# EAGLE design X16-Backplane1 (EAGLE 9.6.2)

## Sheet 1 of 2
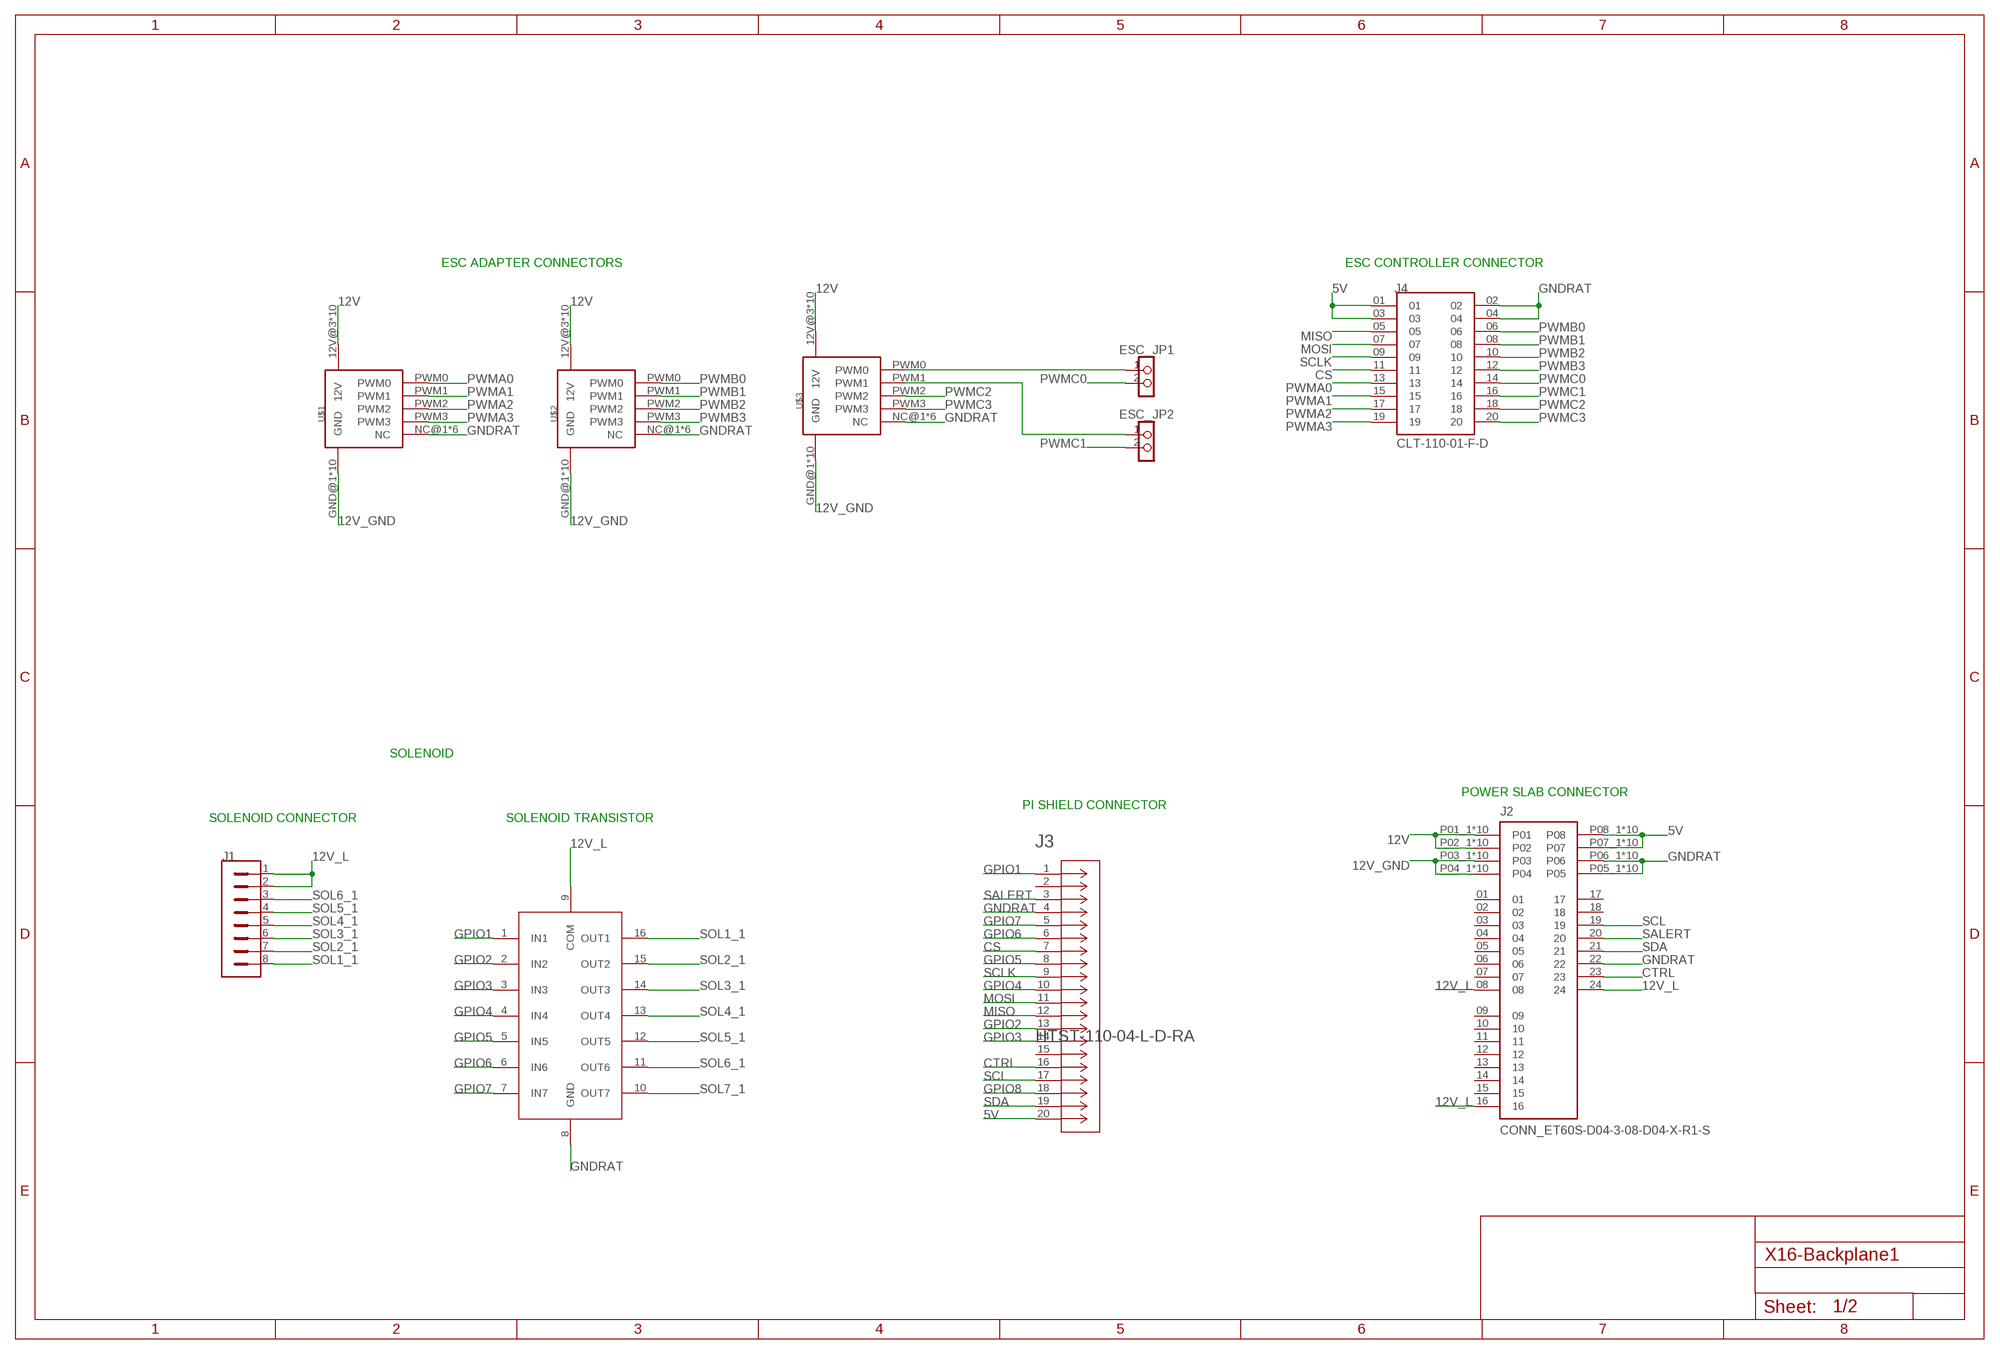
[diagram p0: schematic, sheet 1]

### Parts
ESC_JP1  TEST_PIN-1X2  [1X02]
ESC_JP2  TEST_PIN-1X2  [1X02]
J1  CONN_PXC-8-RA-1778683  [PXC-8-RA-1778683]
J2  CONN_ET60S-D04-3-08-D04-X-R1-S  [SAMTEC_ET60S-D04-3-08-D04-X-R1-S]
J3  HTST-110-04-L-D-RA  [CONN_HTST-110-04/05-X-D-RA_SAI]
J4  CLT-110-01-F-D  [SAMTEC_CLT-110-01-F-D]
U2  TRANS_ULN2003AD  [16-SOIC]
U$1  CONN_BACKPLANE_ESC_ADAPTER_NEW  [CONN_BACKPLANE_ESC_ADAPTER]
U$2  CONN_BACKPLANE_ESC_ADAPTER_NEW  [CONN_BACKPLANE_ESC_ADAPTER]
U$3  CONN_BACKPLANE_ESC_ADAPTER_NEW  [CONN_BACKPLANE_ESC_ADAPTER]

### Nets
5V: J2.P07_1(P07) J2.P07_2(P07) J2.P07_3(P07) J2.P07_4(P07) J2.P07_5(P07) J2.P07_6(P07) J2.P07_7(P07) J2.P07_8(P07) J2.P07_9(P07) J2.P07_10(P07) J2.P08_1(P08) J2.P08_2(P08) J2.P08_3(P08) J2.P08_4(P08) J2.P08_5(P08) J2.P08_6(P08) J2.P08_7(P08) J2.P08_8(P08) J2.P08_9(P08) J2.P08_10(P08) J3.20 J4.01 J4.03 ; also sheet 2
12V: J2.P01_1(P01) J2.P01_2(P01) J2.P01_3(P01) J2.P01_4(P01) J2.P01_5(P01) J2.P01_6(P01) J2.P01_7(P01) J2.P01_8(P01) J2.P01_9(P01) J2.P01_10(P01) J2.P02_1(P02) J2.P02_2(P02) J2.P02_3(P02) J2.P02_4(P02) J2.P02_5(P02) J2.P02_6(P02) J2.P02_7(P02) J2.P02_8(P02) J2.P02_9(P02) J2.P02_10(P02) U$1.12V@3(12V) U$1.12V@4(12V) U$1.12V@5(12V) U$1.12V@6(12V) U$1.12V@7(12V) U$1.12V@8(12V) U$1.12V@9(12V) U$1.12V@10(12V) U$1.12V@11(12V) U$1.12V@12(12V) U$2.12V@3(12V) U$2.12V@4(12V) U$2.12V@5(12V) U$2.12V@6(12V) U$2.12V@7(12V) U$2.12V@8(12V) U$2.12V@9(12V) U$2.12V@10(12V) U$2.12V@11(12V) U$2.12V@12(12V) U$3.12V@3(12V) U$3.12V@4(12V) U$3.12V@5(12V) U$3.12V@6(12V) U$3.12V@7(12V) U$3.12V@8(12V) U$3.12V@9(12V) U$3.12V@10(12V) U$3.12V@11(12V) U$3.12V@12(12V) ; also sheet 2
12V_GND: J2.P03_1(P03) J2.P03_2(P03) J2.P03_3(P03) J2.P03_4(P03) J2.P03_5(P03) J2.P03_6(P03) J2.P03_7(P03) J2.P03_8(P03) J2.P03_9(P03) J2.P03_10(P03) J2.P04_1(P04) J2.P04_2(P04) J2.P04_3(P04) J2.P04_4(P04) J2.P04_5(P04) J2.P04_6(P04) J2.P04_7(P04) J2.P04_8(P04) J2.P04_9(P04) J2.P04_10(P04) U$1.GND@1(GND) U$1.GND@2(GND) U$1.GND@3(GND) U$1.GND@4(GND) U$1.GND@5(GND) U$1.GND@6(GND) U$1.GND@7(GND) U$1.GND@8(GND) U$1.GND@9(GND) U$1.GND@10(GND) U$2.GND@1(GND) U$2.GND@2(GND) U$2.GND@3(GND) U$2.GND@4(GND) U$2.GND@5(GND) U$2.GND@6(GND) U$2.GND@7(GND) U$2.GND@8(GND) U$2.GND@9(GND) U$2.GND@10(GND) U$3.GND@1(GND) U$3.GND@2(GND) U$3.GND@3(GND) U$3.GND@4(GND) U$3.GND@5(GND) U$3.GND@6(GND) U$3.GND@7(GND) U$3.GND@8(GND) U$3.GND@9(GND) U$3.GND@10(GND) ; also sheet 2
12V_L: J1.1 J1.2 J2.08 J2.16 J2.24 U2.9(COM)
CS: J3.7 J4.11 ; also sheet 2
CTRL: J2.23 J3.16
GNDRAT: J2.22 J2.P05_1(P05) J2.P05_2(P05) J2.P05_3(P05) J2.P05_4(P05) J2.P05_5(P05) J2.P05_6(P05) J2.P05_7(P05) J2.P05_8(P05) J2.P05_9(P05) J2.P05_10(P05) J2.P06_1(P06) J2.P06_2(P06) J2.P06_3(P06) J2.P06_4(P06) J2.P06_5(P06) J2.P06_6(P06) J2.P06_7(P06) J2.P06_8(P06) J2.P06_9(P06) J2.P06_10(P06) J3.4 J4.02 J4.04 U2.8(GND) U$1.NC@1(NC) U$1.NC@2(NC) U$1.NC@3(NC) U$1.NC@4(NC) U$1.NC@5(NC) U$1.NC@6(NC) U$2.NC@1(NC) U$2.NC@2(NC) U$2.NC@3(NC) U$2.NC@4(NC) U$2.NC@5(NC) U$2.NC@6(NC) U$3.NC@1(NC) U$3.NC@2(NC) U$3.NC@3(NC) U$3.NC@4(NC) U$3.NC@5(NC) U$3.NC@6(NC) ; also sheet 2
GPIO1: J3.1 U2.1(IN1)
GPIO2: J3.13 U2.2(IN2)
GPIO3: J3.14 U2.3(IN3)
GPIO4: J3.10 U2.4(IN4)
GPIO5: J3.8 U2.5(IN5)
GPIO6: J3.6 U2.6(IN6)
GPIO7: J3.5 U2.7(IN7)
GPIO8: J3.18
MISO: J3.12 J4.05 ; also sheet 2
MOSI: J3.11 J4.07 ; also sheet 2
N$1: ESC_JP1.1 U$3.PWM0
N$3: ESC_JP2.1 U$3.PWM1
PWMA0: J4.13 U$1.PWM0
PWMA1: J4.15 U$1.PWM1
PWMA2: J4.17 U$1.PWM2
PWMA3: J4.19 U$1.PWM3
PWMB0: J4.06 U$2.PWM0
PWMB1: J4.08 U$2.PWM1
PWMB2: J4.10 U$2.PWM2
PWMB3: J4.12 U$2.PWM3
PWMC0: ESC_JP1.2 J4.14 ; also sheet 2
PWMC1: ESC_JP2.2 J4.16 ; also sheet 2
PWMC2: J4.18 U$3.PWM2
PWMC3: J4.20 U$3.PWM3
SALERT: J2.20 J3.3
SCL: J2.19 J3.17
SCLK: J3.9 J4.09 ; also sheet 2
SDA: J2.21 J3.19
SOL1_1: J1.8 U2.16(OUT1)
SOL2_1: J1.7 U2.15(OUT2)
SOL3_1: J1.6 U2.14(OUT3)
SOL4_1: J1.5 U2.13(OUT4)
SOL5_1: J1.4 U2.12(OUT5)
SOL6_1: J1.3 U2.11(OUT6)
SOL7_1: U2.10(OUT7)
Unconnected: J2.01 J2.02 J2.03 J2.04 J2.05 J2.06 J2.07 J2.09 J2.10 J2.11 J2.12 J2.13 J2.14 J2.15 J2.17 J2.18 J3.2 J3.15

### Notes on the sheet
- ESC ADAPTER CONNECTORS | ESC CONTROLLER CONNECTOR
- SOLENOID
- POWER SLAB CONNECTOR
- PI SHIELD CONNECTOR
- SOLENOID CONNECTOR | SOLENOID TRANSISTOR

## Sheet 2 of 2
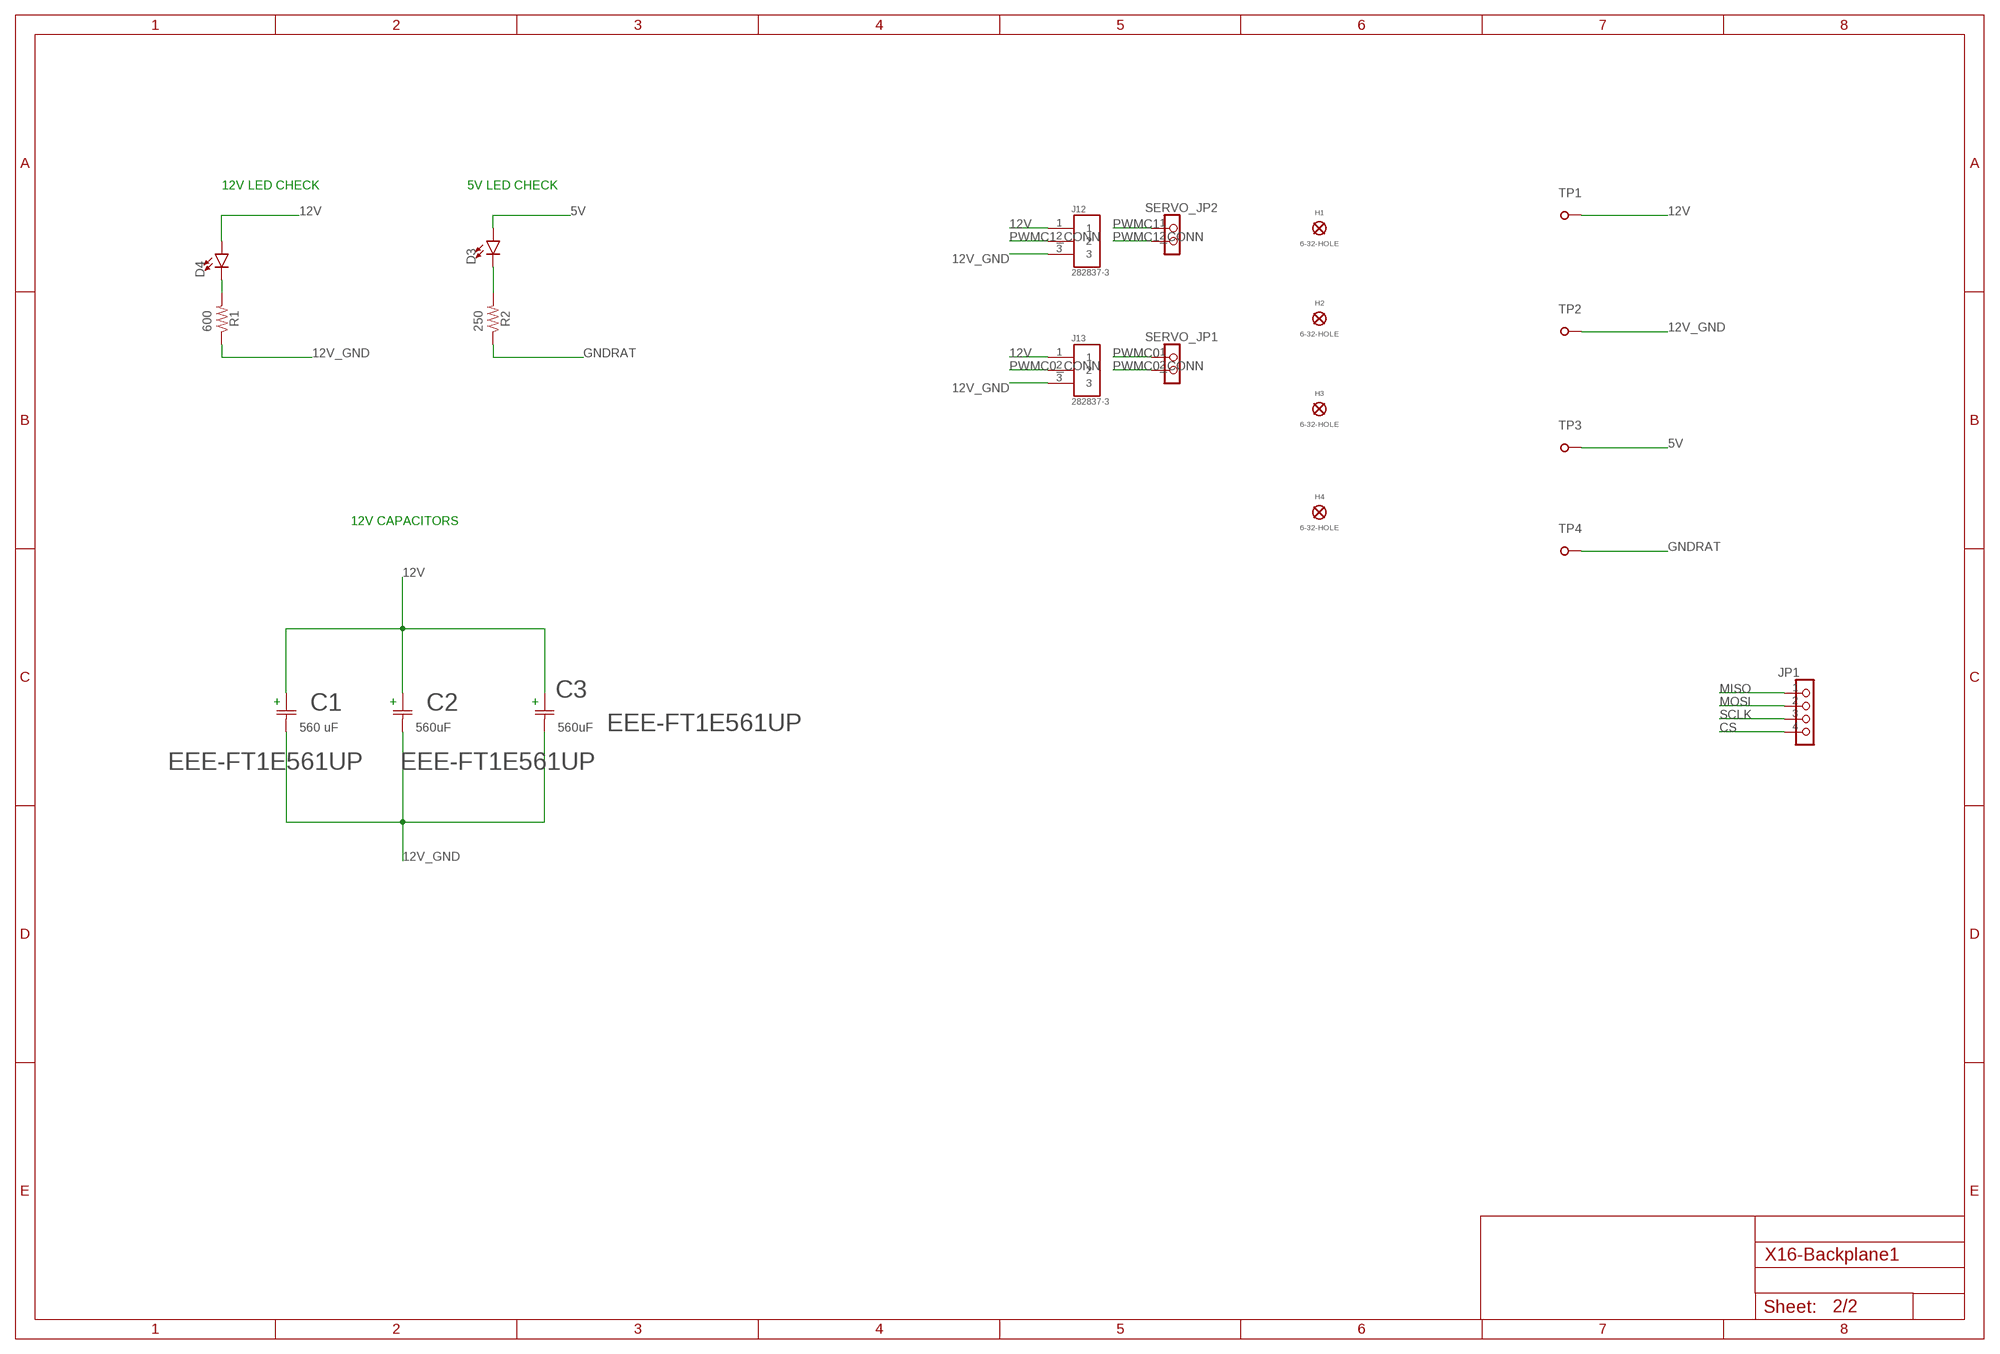
[diagram p1: schematic, sheet 2]

### Parts
C1  EEE-FT1E561UP  [CAP_FT_F_PAN]
C2  EEE-FT1E561UP  [CAP_FT_F_PAN]
C3  EEE-FT1E561UP  [CAP_FT_F_PAN]
D3  LEDCHIPLED_0805  [CHIPLED_0805]
D4  LEDCHIPLED_0805  [CHIPLED_0805]
H1  6-32-HOLE  [6-32-HOLE]
H2  6-32-HOLE  [6-32-HOLE]
H3  6-32-HOLE  [6-32-HOLE]
H4  6-32-HOLE  [6-32-HOLE]
J12  282837-3  [TE_282837-3]
J13  282837-3  [TE_282837-3]
JP1  TEST_PIN-1X4  [1X04]
R1  RESISTOR0603  [0603]
R2  RESISTOR0603  [0603]
SERVO_JP1  TEST_PIN-1X2  [1X02]
SERVO_JP2  TEST_PIN-1X2  [1X02]
TP1  TESTPOINT_5.04MM  [TESTPOINT_5.04MM]
TP2  TESTPOINT_5.04MM  [TESTPOINT_5.04MM]
TP3  TESTPOINT_5.04MM  [TESTPOINT_5.04MM]
TP4  TESTPOINT_5.04MM  [TESTPOINT_5.04MM]

### Nets
5V: D3.A TP3.TP ; also sheet 1
12V: C1.1 C2.1 C3.1 D4.A J12.1 J13.1 TP1.TP ; also sheet 1
12V_GND: C1.2 C2.2 C3.2 J12.3 J13.3 R1.1 TP2.TP ; also sheet 1
CS: JP1.4 ; also sheet 1
GNDRAT: R2.1 TP4.TP ; also sheet 1
MISO: JP1.1 ; also sheet 1
MOSI: JP1.2 ; also sheet 1
N$2: D4.C R1.2
N$5: D3.C R2.2
PWMC0: SERVO_JP1.1 ; also sheet 1
PWMC0_CONN: J13.2 SERVO_JP1.2
PWMC1: SERVO_JP2.1 ; also sheet 1
PWMC1_CONN: J12.2 SERVO_JP2.2
SCLK: JP1.3 ; also sheet 1

### Notes on the sheet
- 12V LED CHECK | 5V LED CHECK
- 12V CAPACITORS
- + | + | +

## Library data of the parts
C1 = X16_Backplane:EEE-FT1E561UP; C1: 560 uF; COPYRIGHT: Copyright (C) 2023 Ultra Librarian. All rights reserved.; MANUFACTURER_PART_NUMBER: EEE-FT1E561UP; MFR_NAME: Panasonic
C2 = X16_Backplane:EEE-FT1E561UP; C2: 560uF; COPYRIGHT: Copyright (C) 2023 Ultra Librarian. All rights reserved.; MANUFACTURER_PART_NUMBER: EEE-FT1E561UP; MFR_NAME: Panasonic
C3 = X16_Backplane:EEE-FT1E561UP; C3: 560uF; COPYRIGHT: Copyright (C) 2023 Ultra Librarian. All rights reserved.; MANUFACTURER_PART_NUMBER: EEE-FT1E561UP; MFR_NAME: Panasonic
D3 D4 = led:LED: LED OSRAM: - CHIPLED LG R971, LG N971, LY N971, LG Q971, LY Q971, LO R971, LY R971 LH N974, LH R974 LS Q976, LO Q976, LY Q976 LO Q996 - Hyper CHIPLED LW Q18S LB Q993, LB Q99A, LB R99A - SideLED LS A670, LO A670, LY A670, LG A670, LP A670 LB A673, LV A673, LT A673, LW A673 LH A674 LY A675 LS A676, LA A676, LO A676, LY A676, LW A676 LS A679, LY A679, LG A679 - Hyper Micro SIDELED® LS Y876, LA Y876, LO Y876, LY Y876 LT Y87S - SmartLED LW L88C, LW L88S LB L89C, LB L89S, LG L890 LS L89K, LO L89K, LY L89K LS L896, LA L896, LO L896, LY L896 - TOPLED LS T670, LO T670, LY T670, LG T670, LP T670 LSG T670, LSP T670, LSY T670, LOP T670, LYG T670 LG T671, LOG T671, LSG T671 LB T673, LV T673, LT T673, LW T673 LH T674 LS T676, LA T676, LO T676, LY T676, LB T676, LH T676, LSB T676, LW T676 LB T67C, LV T67C, LT T67C, LS T67K, LO T67K, LY T67K, LW E67C LS E67B, LA E67B, LO E67B, LY E67B, LB E67C, LV E67C, LT E67C LW T67C LS T679, LY T679, LG T679 LS T770, LO T770, LY T770, LG T770, LP T770 LB T773, LV T773, LT T773, LW T773 LH T774 LS E675, LA E675, LY E675, LS T675 LS T776, LA T776, LO T776, LY T776, LB T776 LHGB T686 LT T68C, LB T68C - Hyper Mini TOPLED® LB M676 - Mini TOPLED Santana® LG M470 LS M47K, LO M47K, LY M47K Source: http://www.osram.convergy.de LUXEON: - LUMILED® LXK2-PW12-R00, LXK2-PW12-S00, LXK2-PW14-U00, LXK2-PW14-V00 LXK2-PM12-R00, LXK2-PM12-S00, LXK2-PM14-U00 LXK2-PE12-Q00, LXK2-PE12-R00, LXK2-PE12-S00, LXK2-PE14-T00, LXK2-PE14-U00 LXK2-PB12-K00, LXK2-PB12-L00, LXK2-PB12-M00, LXK2-PB14-N00, LXK2-PB14-P00, LXK2-PB14-Q00 LXK2-PR12-L00, LXK2-PR12-M00, LXK2-PR14-Q00, LXK2-PR14-R00 LXK2-PD12-Q00, LXK2-PD12-R00, LXK2-PD12-S00 LXK2-PH12-R00, LXK2-PH12-S00 LXK2-PL12-P00, LXK2-PL12-Q00, LXK2-PL12-R00 Source: www.luxeon.com KINGBRIGHT: KA-3528ASYC Source: www.kingbright.com
ESC_JP1 ESC_JP2 SERVO_JP1 SERVO_JP2 = X16-ExtraComponents:TEST_PIN-1X2: PIN HEADER
H1-H4 = X16_Backplane:6-32-HOLE
J1 = X16_Backplane:CONN_PXC-8-RA-1778683: Backplane to Solenoid Connector
J2 = X16_Backplane:CONN_ET60S-D04-3-08-D04-X-R1-S: Backplane to Power Slab Connector: Power to the Board .100" EXTreme Ten60Power 60 Amp Signal/Power Combo Socket Strip; MANUFACTURER: Samtec; MAXIMUM_PACKAGE_HEIGHT: 10 mm; PARTREV: G; STANDARD: Manufacturer Recommendations
J3 = X16_Backplane:HTST-110-04-L-D-RA; COPYRIGHT: Copyright (C) 2023 Ultra Librarian. All rights reserved.; MANUFACTURER_PART_NUMBER: HTST-110-04-L-D-RA; MFR_NAME: Samtec Inc; TYPE: Headers, Male Pins
J4 = X16_Backplane:CLT-110-01-F-D; MANUFACTURER: SAMTEC
J12 J13 = X16_Backplane:282837-3: TERMI-BLOK PCB MOUNT 3P; MANUFACTURER: TE CONNECTIVITY; PARTREV: H; STANDARD: Manufacturer Recommendations
JP1 = X16-ExtraComponents:TEST_PIN-1X4: PIN HEADER
R1 = SparkFun-Resistors:RESISTOR: Generic Resistor Package; PROD_ID: 600
R2 = SparkFun-Resistors:RESISTOR: Generic Resistor Package; PROD_ID: 250
TP1-TP4 = X16_Backplane:TESTPOINT_5.04MM: TEST PIN
U2 = X16_Backplane:TRANS_ULN2003AD; A1_MIN: 0.25; A_MAX: 1.75; A_MIN: 1.75; A_NOM: 1.75; B_MAX: 0.51; B_MIN: 0.33; B_NOM: 0.42; D2_MAX: 0.0; D_MAX: 10.0; D_MIN: 9.8; D_NOM: 9.9; E1_MAX: 4.0; E1_MIN: 3.8; E1_NOM: 3.9; E2_MAX: 0.0; ENOM: 1.27; E_MAX: 6.2; E_MIN: 5.8; E_NOM: 6.0; L_MAX: 1.27; L_MIN: 0.38; L_NOM: 0.825; MANUFACTURER: Diodes Inc.; PIN_COUNT: 16.0; SNAPEDA_PACKAGE_ID: 27538; STANDARD: IPC 7351B
U$1-U$3 = X16_Backplane:CONN_BACKPLANE_ESC_ADAPTER_NEW: ESC Adapter to Backplane

## Board
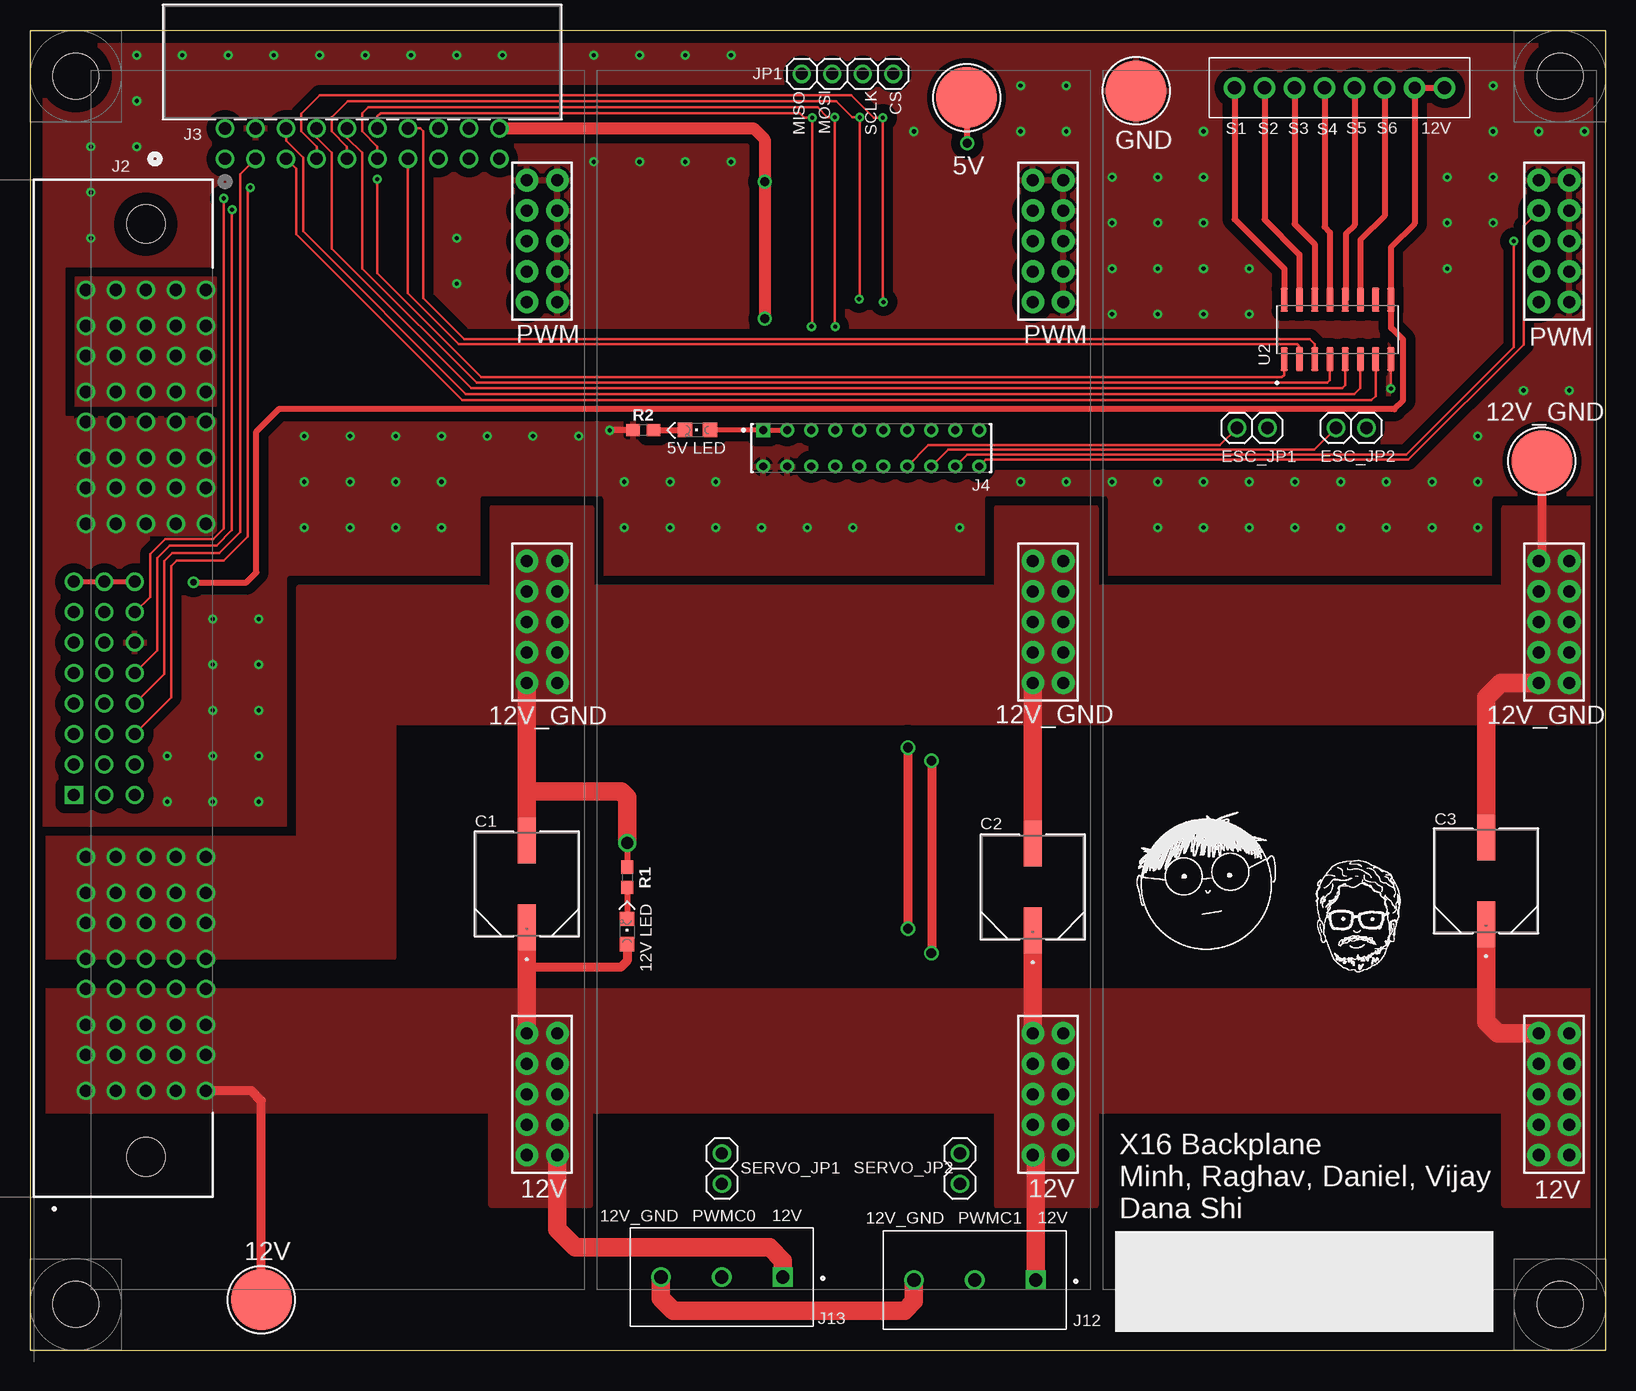
[diagram p2: board, top side]
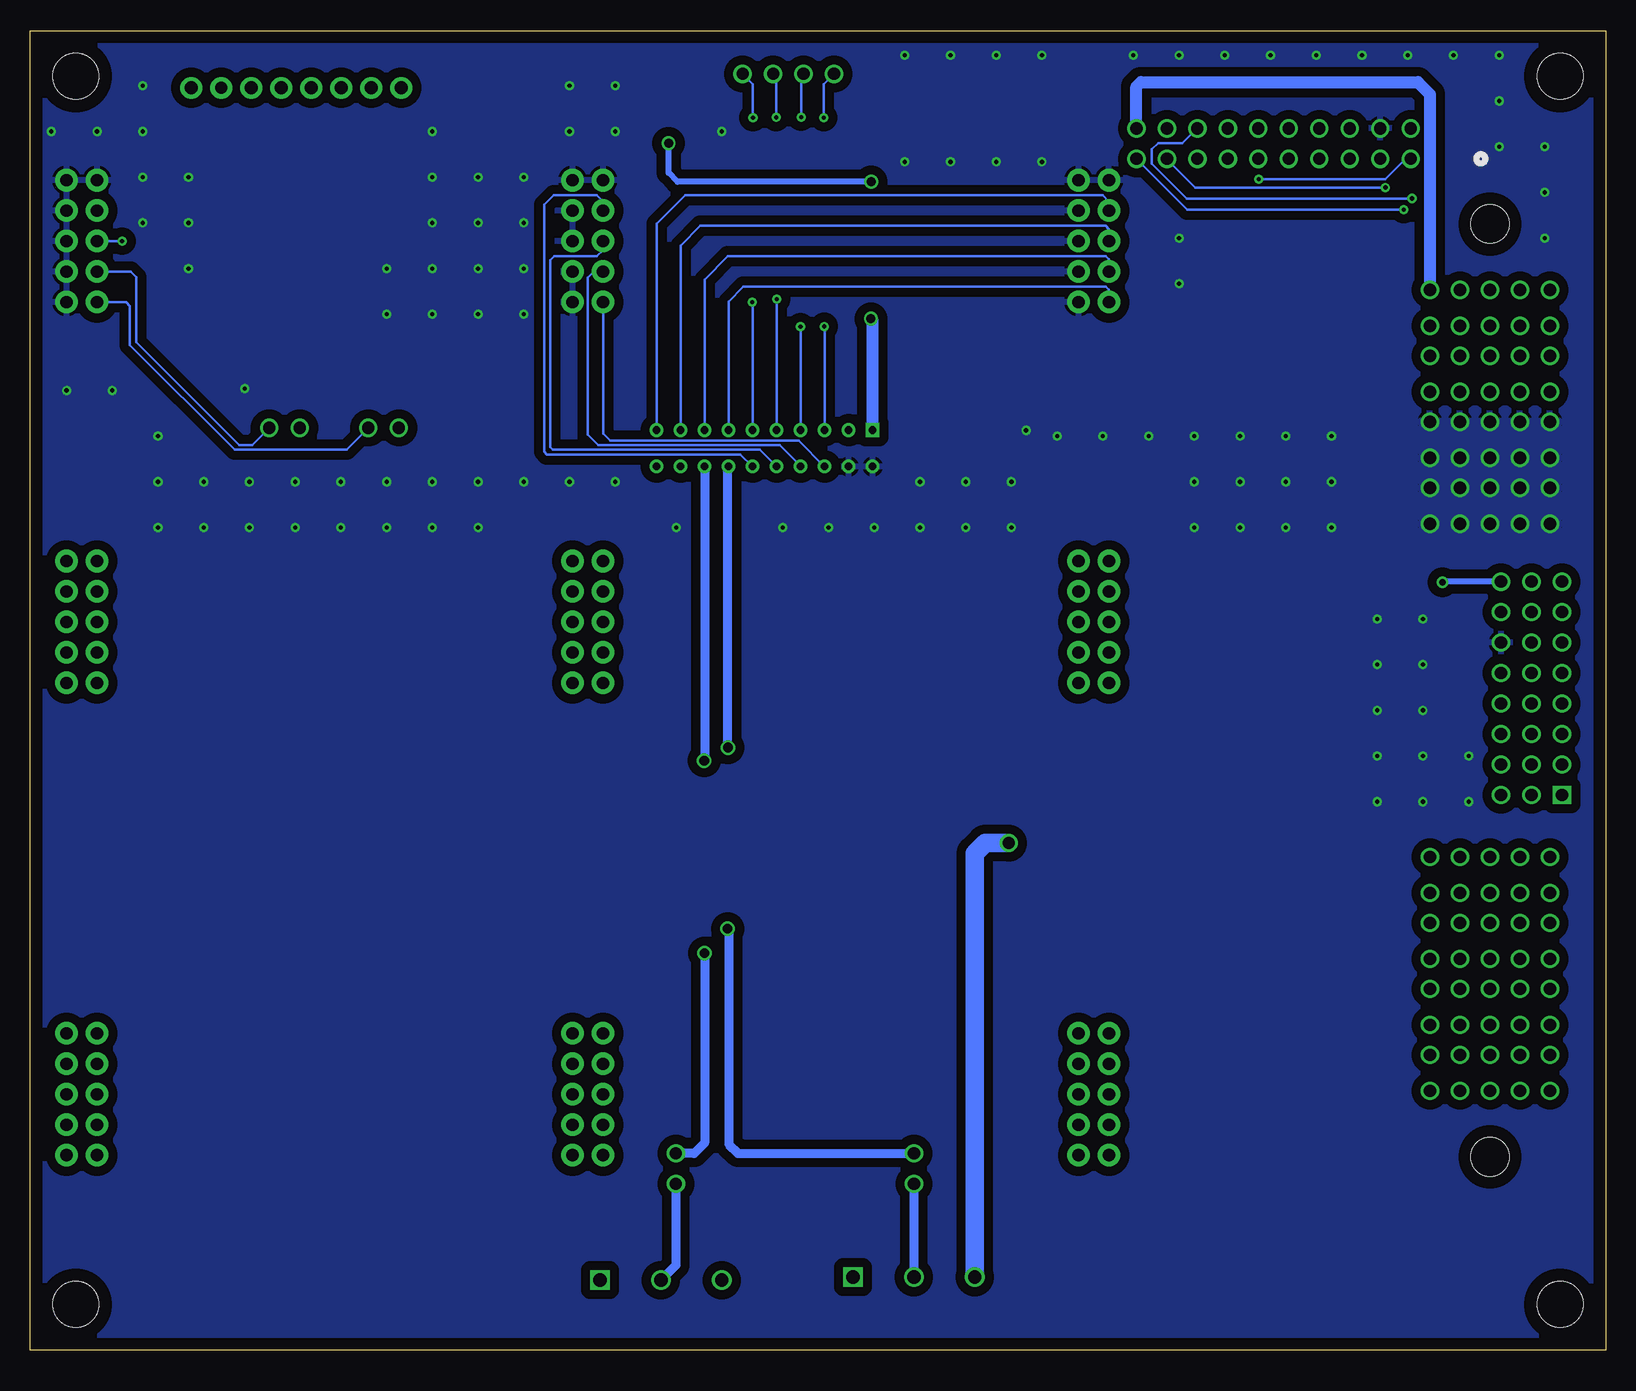
[diagram p3: board, bottom side, seen from below]

Size 131.32 x 110 mm. Coordinates in mm from the lower left corner, seen from the top.
Outline: 0,0 131.32,0 131.32,110 0,110 0,0
Copper layers (1*16): Top 0.035mm / dielectric 1.5mm / Bottom 0.035mm
Design rules "477": minimum track width 6mil, minimum drill 0.35mm, track to track 6mil, track to pad 6mil, pad to pad 6mil, via to via 6mil, smd to smd 6mil, copper to edge 40mil, drill to drill 6mil, minimum pad ring 10mil, minimum via ring 8mil, stop-mask expansion 4mil, vias tented up to drill 0mil, thermal gap 10mil

### Footprints (pad centres in the part's own frame; a part is rotated, then mirrored left to right if it is on the bottom)
CAP_FT_F_PAN = smd 3.81 x 1.499: 1 -3.607,0; 2 3.607,0
CHIPLED_0805 = smd 1.2 x 1.2: A 0,-1.05; C 0,1.05
1X02 = drill 1.016: 1 -1.27,0; 2 1.27,0
6-32-HOLE = hole 3.81: 0,0
PXC-8-RA-1778683 = drill 1.1 pad 1.8: 1 0,0; 3 5,0; 4 7.5,0; 5 10,0; 6 12.5,0; 7 15,0; 8 17.5,0 | drill 1 pad 1.8: 2 2.5,0
SAMTEC_ET60S-D04-3-08-D04-X-R1-S = drill 1.02 square: 01 8.71,-6 | drill 1.02: 02 6.17,-6; 03 3.63,-6; 04 1.09,-6; 05 -1.45,-6; 06 -3.99,-6; 07 -6.53,-6; 08 -9.07,-6; 09 8.71,-3.46; 10 6.17,-3.46; 11 3.63,-3.46; 12 1.09,-3.46; 13 -1.45,-3.46; 14 -3.99,-3.46; 15 -6.53,-3.46; 16 -9.07,-3.46; 17 8.71,-0.92; 18 6.17,-0.92; 19 3.63,-0.92; 20 1.09,-0.92; 21 -1.45,-0.92; 22 -3.99,-0.92; 23 -6.53,-0.92; 24 -9.07,-0.92; P01_1 33.38,5; P01_2 33.38,2.5; P01_3 33.38,0; P01_4 33.38,-2.5; P01_5 33.38,-5; P01_6 30.38,-5; P01_7 30.38,-2.5; P01_8 30.38,0; P01_9 30.38,2.5; P01_10 30.38,5; P02_1 27.88,5; P02_2 27.88,2.5; P02_3 27.88,0; P02_4 27.88,-2.5; P02_5 27.88,-5; P02_6 24.88,-5; P02_7 24.88,-2.5; P02_8 24.88,0; P02_9 24.88,2.5; P02_10 24.88,5; P03_1 22.38,5; P03_2 22.38,2.5; P03_3 22.38,0; P03_4 22.38,-2.5; P03_5 22.38,-5; P03_6 19.38,-5; P03_7 19.38,-2.5; P03_8 19.38,0; P03_9 19.38,2.5; P03_10 19.38,5; P04_1 16.88,5; P04_2 16.88,2.5; P04_3 16.88,0; P04_4 16.88,-2.5; P04_5 16.88,-5; P04_6 13.88,-5; P04_7 13.88,-2.5; P04_8 13.88,0; P04_9 13.88,2.5; P04_10 13.88,5; P05_1 -13.88,5; P05_2 -13.88,2.5; P05_3 -13.88,0; P05_4 -13.88,-2.5; P05_5 -13.88,-5; P05_6 -16.88,-5; P05_7 -16.88,-2.5; P05_8 -16.88,0; P05_9 -16.88,2.5; P05_10 -16.88,5; P06_1 -19.38,5; P06_2 -19.38,2.5; P06_3 -19.38,0; P06_4 -19.38,-2.5; P06_5 -19.38,-5; P06_6 -22.38,-5; P06_7 -22.38,-2.5; P06_8 -22.38,0; P06_9 -22.38,2.5; P06_10 -22.38,5; P07_1 -24.88,5; P07_2 -24.88,2.5; P07_3 -24.88,0; P07_4 -24.88,-2.5; P07_5 -24.88,-5; P07_6 -27.88,-5; P07_7 -27.88,-2.5; P07_8 -27.88,0; P07_9 -27.88,2.5; P07_10 -27.88,5; P08_1 -30.38,5; P08_2 -30.38,2.5; P08_3 -30.38,0; P08_4 -30.38,-2.5; P08_5 -30.38,-5; P08_6 -33.38,-5; P08_7 -33.38,-2.5; P08_8 -33.38,0; P08_9 -33.38,2.5; P08_10 -33.38,5 | hole 3.2: -38.88,0; 38.88,0
CONN_HTST-110-04/05-X-D-RA_SAI = drill 1.016 pad 1.524: 1 0,0; 2 0,-2.54; 3 -2.54,0; 4 -2.54,-2.54; 5 -5.08,0; 6 -5.08,-2.54; 7 -7.62,0; 8 -7.62,-2.54; 9 -10.16,0; 10 -10.16,-2.54; 11 -12.7,0; 12 -12.7,-2.54; 13 -15.24,0; 14 -15.24,-2.54; 15 -17.78,0; 16 -17.78,-2.54; 17 -20.32,0; 18 -20.32,-2.54; 19 -22.86,0; 20 -22.86,-2.54
SAMTEC_CLT-110-01-F-D = drill 0.64 pad 1.04 square: 01 9,-1.51 | drill 0.64 pad 1.04: 02 9,1.51; 03 7,-1.51; 04 7,1.51; 05 5,-1.51; 06 5,1.51; 07 3,-1.51; 08 3,1.51; 09 1,-1.51; 10 1,1.51; 11 -1,-1.51; 12 -1,1.51; 13 -3,-1.51; 14 -3,1.51; 15 -5,-1.51; 16 -5,1.51; 17 -7,-1.51; 18 -7,1.51; 19 -9,-1.51; 20 -9,1.51
TE_282837-3 = drill 1.1 square: 1 -5.08,0 | drill 1.1: 2 0,0; 3 5.08,0
1X04 = drill 1.016: 1 -3.81,0; 2 -1.27,0; 3 1.27,0; 4 3.81,0
0603 = smd 1.1 x 1: 1 -0.85,0; 2 0.85,0
TESTPOINT_5.04MM = smd 5.08 x 5.08: TP 0,0
16-SOIC = smd 1.97 x 0.6: 1 -2.475,4.445; 2 -2.475,3.175; 3 -2.475,1.905; 4 -2.475,0.635; 5 -2.475,-0.635; 6 -2.475,-1.905; 7 -2.475,-3.175; 8 -2.475,-4.445; 9 2.475,-4.445; 10 2.475,-3.175; 11 2.475,-1.905; 12 2.475,-0.635; 13 2.475,0.635; 14 2.475,1.905; 15 2.475,3.175; 16 2.475,4.445
CONN_BACKPLANE_ESC_ADAPTER = drill 1.016 pad 1.88: 12V@3 90.424,36.322; 12V@4 90.424,38.862; 12V@5 87.884,36.322; 12V@6 87.884,38.862; 12V@7 85.344,36.322; 12V@8 85.344,38.862; 12V@9 82.804,36.322; 12V@10 82.804,38.862; 12V@11 80.264,36.322; 12V@12 80.264,38.862; GND@1 51.054,38.862; GND@2 51.054,36.322; GND@3 48.514,38.862; GND@4 48.514,36.322; GND@5 45.974,38.862; GND@6 45.974,36.322; GND@7 43.434,38.862; GND@8 43.434,36.322; GND@9 40.894,38.862; GND@10 40.894,36.322; NC@1 19.304,38.862; NC@2 16.764,38.862; NC@3 14.224,38.862; NC@4 11.684,38.862; NC@5 9.144,38.862; NC@6 9.144,36.322; PWM0 19.304,36.322; PWM1 16.764,36.322; PWM2 14.224,36.322; PWM3 11.684,36.322

### Placement (x,y rotation side)
C1  41.4,38.86 90 top
C2  83.57,38.61 90 top
C3  121.34,39.12 90 top
D3  55.63,76.71 90 top
D4  49.76,34.9 0 top
ESC_JP1  101.85,76.89 180 top
ESC_JP2  110.11,76.89 180 top
H1  3.81,106.2 0 top
H2  127.51,106.2 0 top
H3  3.81,3.81 0 top
H4  127.51,3.81 0 top
J1  117.88,105.23 180 top
J2  9.65,55 270 top
J3  16.26,99.31 180 top
J4  70.1,75.18 180 top
J12  78.74,5.84 180 top
J13  57.66,6.1 180 top
JP1  68.12,106.4 0 top
R1  49.76,39.42 270 top
R2  51.1,76.71 0 top
SERVO_JP1  57.66,15.14 270 top
SERVO_JP2  77.5,15.14 270 top
TP1  19.28,4.22 0 top
TP2  125.98,74.12 0 top
TP3  78.05,104.42 0 top
TP4  92.18,104.98 0 top
U2  108.97,85.09 90 top
U$1  5.08,106.68 270 top
U$2  47.24,106.68 270 top
U$3  89.41,106.68 270 top

### Tracks (layer width: path | path; a pad name or v marks a point on that pad's centre or on a via)
5V  (via drill 0.75)
  Top 0.406: J4.03 J4.01 56.69,76.69 D3.A
  Top 0.508: v78.11,100.61 78.11,104.44 78.08,104.47 78.08,104.44 TP3.TP
  Top 1.016: J3.20 60.3,101.85 61.21,100.94 v61.21,97.41 61.21,86 v61.24,85.98
  Bottom 0.508: v61.21,97.41 77.37,97.41 78.11,98.15 v78.11,100.61
  Bottom 1.016: J3.20 39.12,105.33 38.73,105.72 15.67,105.72 14.65,104.69 J2.P08_10 | v61.24,85.98 61.11,85.85 61.11,76.7 J4.01
  pour Top (no thermals): 3.81,78.74 15.49,78.74 15.49,89.41 3.81,89.41
12V
  Top 0.762: TP1.TP 19.28,20.8 18.46,21.62 J2.P01_1 | D4.A 49.76,32.46 49.23,31.93 41.45,31.93 41.4,31.98
  Top 1.524: C2.1 U$2.12V@11 | U$1.12V@4 43.94,10.06 45.44,8.56 61.65,8.56 62.74,7.47 J13.1 | U$2.12V@3 83.82,16 J12.1 | U$3.12V@11 122.3,26.42 121.34,27.38 C3.1 | C1.1 41.4,31.98 U$1.12V@11
  pour Top (isolate 1.27, no thermals): -1.07,29.97 133.27,29.97 133.27,19.94 -1.07,19.94
  pour Top (isolate 1.27, no thermals): 38.46,29.97 46.66,29.97 46.66,12.09 38.46,12.09
  pour Top (isolate 1.27, no thermals): 80.59,29.97 88.8,29.97 88.8,12.06 80.59,12.06
  pour Top (isolate 1.27, no thermals): 122.86,29.97 131.06,29.97 131.06,12.09 122.86,12.09
12V_GND  (via drill 1)
  Top 0.508: v49.76,42.27 R1.1
  Top 0.762: U$3.GND@10 125.98,66.04 TP2.TP
  Top 1.524: J12.3 73.66,4.06 72.9,3.3 53.59,3.3 52.58,4.32 J13.3 | U$2.GND@2 C2.2 | U$3.GND@2 122.56,55.63 121.34,54.41 C3.2 | C1.2 41.4,46.56 | U$1.GND@2 41.4,46.56 | v49.76,42.27 49.76,46.08 49.28,46.56 41.4,46.56
  Bottom 1.524: J13.3 52.58,41.4 51.71,42.27 v49.76,42.27
  pour Top (isolate 1.27, no thermals): -0.69,32.77 -0.69,42.67 22.43,42.67 22.43,63.58 131.88,63.58 131.88,52.32 30.28,52.32 30.28,32.77
  pour Top (isolate 1.27, no thermals): 38.56,70.21 46.76,70.21 46.76,52.32 38.56,52.32
  pour Top (isolate 1.27, no thermals): 80.59,70.21 88.8,70.21 88.8,52.32 80.59,52.32
  pour Top (isolate 1.27, no thermals): 122.86,70.21 131.06,70.21 131.06,52.32 122.86,52.32
12V_L  (via drill 0.55)
  Top 0.406: J2.08 J2.16 J2.24
  Top 0.508: v13.61,64.01 18.03,64.01 18.87,64.85 18.87,76.58 20.73,78.44 113.69,78.44 114.43,79.17 114.43,84.25 113.54,85.14 113.51,85.14 113.41,85.24 U2.9 113.41,91.95 115.38,93.92 J1.2 J1.1
  Bottom 0.508: J2.24 13.55,64.07 v13.61,64.01
CS  (via drill 0.35)
  Top 0.203: v71.12,87.38 71.07,87.43 v71.07,102.74 70.33,102.74 68.45,104.62 24.16,104.62 22.61,103.07 22.61,101.6 23.88,100.33 J3.7
  Bottom 0.203: J4.11 71.1,87.36 v71.12,87.38 | v71.07,102.74 71.07,105.54 JP1.4
CTRL  (via drill 0.35)
  Top 0.203: v16.15,96.01 16.15,68.48 15.29,67.61 11.25,67.61 10.01,66.37 10.01,62.8 J2.23
  Bottom 0.203: J3.16 35.28,100.61 37.31,100.61 37.82,100.1 37.82,98.91 34.92,96.01 v16.15,96.01
GNDRAT  (via drill 0.35)
  Top 0.203: U2.8 v113.41,80.16
  Top 0.508: v48.31,76.68 48.34,76.71 R2.1
  other vias: 35.56,92.71 35.56,88.9 22.86,76.2 26.67,76.2 30.48,76.2 34.29,76.2 38.1,76.2 41.91,76.2 45.72,76.2 22.86,72.39 26.67,72.39 30.48,72.39 34.29,72.39 22.86,68.58 26.67,68.58 30.48,68.58 34.29,68.58 49.53,72.39 53.34,72.39 57.15,72.39 49.53,68.58 53.34,68.58 57.15,68.58 60.96,68.58 64.77,68.58 68.58,68.58 77.47,68.58 82.55,72.39 86.36,72.39 90.17,72.39 93.98,72.39 93.98,68.58 97.79,72.39 97.79,68.58 101.6,72.39 101.6,68.58 105.41,68.58 105.41,72.39 109.22,72.39 109.22,68.58 113.03,72.39 113.03,68.58 116.84,68.58 116.84,72.39 120.65,72.39 120.65,68.58 120.65,76.2 124.46,80.01 128.27,80.01 101.6,86.36 97.79,86.36 93.98,86.36 90.17,86.36 90.17,90.17 93.98,90.17 97.79,90.17 101.6,90.17 97.79,93.98 93.98,93.98 90.17,93.98 93.98,97.79 97.79,97.79 90.17,97.79 97.79,101.6 86.36,101.6 82.55,101.6 82.55,105.41 86.36,105.41 73.66,101.6 58.42,99.06 54.61,99.06 50.8,99.06 46.99,99.06 58.42,107.95 54.61,107.95 50.8,107.95 46.99,107.95 39.37,107.95 35.56,107.95 31.75,107.95 27.94,107.95 24.13,107.95 20.32,107.95 16.51,107.95 12.7,107.95 8.89,107.95 8.89,104.14 8.89,100.33 5.08,100.33 5.08,96.52 5.08,92.71 118.11,97.79 121.92,97.79 121.92,93.98 118.11,93.98 118.11,90.17 121.92,101.6 125.73,101.6 129.54,101.6 121.92,105.41 19.05,60.96 15.24,60.96 15.24,57.15 19.05,57.15 19.05,53.34 15.24,53.34 15.24,49.53 19.05,49.53 19.05,45.72 15.24,45.72 11.43,45.72 11.43,49.53
  pour Top (isolate 0.762, rank 6): -16.51,113.79 144.27,113.79 144.27,43.61 -16.51,43.61
  pour Bottom (isolate 0.762, rank 6): -16.76,115.32 144.78,115.32 144.78,-2.51 -16.76,-2.51
  pour Top (no thermals): 3.81,67.97 15.49,67.97 15.49,77.62 3.81,77.62
  pour Bottom (no thermals): 15.49,67.54 3.81,67.54 3.81,77.62 15.49,77.62
GPIO1  (via drill 0.35)
  Top 0.203: v28.93,97.61 28.93,89.79 37.62,81.1 104.32,81.1 104.52,81.31 U2.1
  Bottom 0.203: J3.1 16.69,99.31 18.39,97.61 v28.93,97.61
GPIO2
  Top 0.203: J3.13 31.5,88.11 35.74,83.87 105.59,83.87 105.79,83.67 U2.2
GPIO3
  Top 0.203: J3.14 32.51,101.85 32.77,101.6 32.77,87.68 36.17,84.28 106.66,84.28 107.06,83.87 U2.3
GPIO4
  Top 0.203: J3.10 26.42,101.09 27.69,99.82 27.69,90.17 37.21,80.64 108.1,80.64 108.33,80.87 U2.4
GPIO5
  Top 0.203: J3.8 23.88,101.09 25.15,99.82 25.15,91.85 36.78,80.21 109.35,80.21 109.6,80.47 U2.5
GPIO6
  Top 0.203: J3.6 21.34,100.84 22.76,99.42 22.76,93.27 36.32,79.7 110.36,79.7 110.87,80.21 U2.6
GPIO7
  Top 0.203: J3.5 22.17,98.48 22.17,93.04 36.02,79.2 111.78,79.2 112.14,79.55 U2.7
MISO  (via drill 0.35)
  Top 0.203: v65.13,85.34 65.18,85.39 v65.18,102.74 64.52,102.74 64.14,103.12 29.21,103.12 28.96,102.87 J3.12
  Bottom 0.203: J4.05 65.1,85.32 v65.13,85.34 | JP1.1 65.18,105.54 v65.18,102.74
MOSI  (via drill 0.35)
  Top 0.203: v67.11,85.32 67.06,85.37 v67.06,102.79 66.45,102.79 65.63,103.61 28.17,103.61 27.69,103.12 27.69,101.6 28.96,100.33 J3.11
  Bottom 0.203: J4.07 v67.1,85.32 v67.11,85.32 | v67.06,102.79 67.06,106.2 JP1.2
N$1
  Bottom 0.203: ESC_JP1.1 104.93,75.08 114.28,75.08 122.99,83.8 122.99,87.05 123.32,87.38 U$3.PWM0
N$2
  Top 0.508: R1.2 D4.C
N$3
  Bottom 0.203: ESC_JP2.1 112.8,75.46 113.89,75.46 122.48,84.05 122.48,89.46 122.94,89.92 U$3.PWM1
N$5
  Top 0.203: R2.2
  Top 0.508: R2.2 D3.C
PWMA0
  Bottom 0.203: J4.13 73.1,87.42 71.88,88.65 41.66,88.65 41.4,88.39 U$1.PWM0
PWMA1
  Bottom 0.203: J4.15 75.1,89.23 73.15,91.19 41.66,91.19 41.4,90.93 U$1.PWM1
PWMA2
  Bottom 0.203: J4.17 77.1,92.08 75.46,93.73 41.66,93.73 41.4,93.47 U$1.PWM2
PWMA3
  Bottom 0.203: J4.19 79.1,93.89 76.73,96.27 41.91,96.27 41.4,95.76 U$1.PWM3
PWMB0
  Bottom 0.203: J4.06 65.11,73.67 67.26,75.82 82.96,75.82 83.57,76.43 U$2.PWM0
PWMB1
  Bottom 0.203: J4.08 67.1,73.68 68.86,75.44 83.95,75.44 84.84,76.33 84.84,89.41 84.33,89.92 U$2.PWM1
PWMB2
  Bottom 0.203: J4.10 70.51,75.08 87.76,75.08 87.96,75.29 87.96,90.86 87.63,91.19 84.07,91.19 83.57,91.69 U$2.PWM2
PWMB3
  Bottom 0.203: J4.12 72.11,74.68 88.24,74.68 88.47,74.91 88.47,95.48 87.68,96.27 84.07,96.27 83.57,95.76 U$2.PWM3
PWMC0  (via drill 0.8)
  Top 0.203: J4.14 74.87,75.44 99.14,75.44 ESC_JP1.2
  Top 0.762: v73.18,35.13 73.15,35.15 v73.15,50.24
  Bottom 0.762: v73.18,35.13 73.08,35.03 73.08,17.17 72.31,16.41 SERVO_JP1.1 | v73.15,50.24 73.15,73.63 J4.14
PWMC0_CONN
  Bottom 0.762: SERVO_JP1.2 J13.2
PWMC1  (via drill 0.8)
  Top 0.203: J4.16 76.51,75.08 107.04,75.08 ESC_JP2.2
  Top 0.762: v75.13,49.15 75.13,33.12 v75.11,33.1
  Bottom 0.762: J4.16 75.1,49.18 v75.13,49.15 | v75.11,33.1 75.11,17.27 75.97,16.41 SERVO_JP2.1
PWMC1_CONN
  Bottom 0.762: SERVO_JP2.2 77.5,7.09 J12.2
PWMC2  (via drill 0.35)
  Top 0.203: J4.18 78.11,74.68 114.71,74.68 123.65,83.62 v123.65,92.46
  Bottom 0.203: v123.65,92.46 U$3.PWM2
PWMC3
  Top 0.203: J4.20 79.66,74.23 114.87,74.23 124.46,83.82 124.46,93.7 125.73,94.97 U$3.PWM3
SALERT
  Top 0.203: J3.3 17.53,98.04 17.53,68.2 15.77,66.45 11.86,66.45 11.2,65.79 11.2,56.38 J2.20
SCL  (via drill 0.35)
  Top 0.203: v18.36,96.93 18.16,96.72 18.16,67.84 16.13,65.81 12.24,65.81 11.79,65.35 11.79,54.42 J2.19
  Bottom 0.203: J3.17 36.58,99.29 34.21,96.93 v18.36,96.93
SCLK  (via drill 0.35)
  Top 0.203: v69.09,87.63 69.14,87.68 v69.14,102.77 68.53,102.77 67.18,104.11 26.47,104.11 25.15,102.79 25.15,101.6 26.42,100.33 J3.9
  Bottom 0.203: J4.09 69.1,87.61 v69.09,87.63 | v69.14,102.77 69.14,106.15 JP1.3
SDA  (via drill 0.35)
  Top 0.203: v16.84,95.07 16.82,95.05 16.82,68.35 15.54,67.08 11.63,67.08 10.59,66.04 10.59,58.31 J2.21
  Bottom 0.203: J3.19 34.87,95.07 v16.84,95.07
SOL1_1
  Top 0.508: J1.8 100.38,94.28 104.52,90.14 U2.16
SOL2_1
  Top 0.508: J1.7 102.88,94.25 105.79,91.34 U2.15
SOL3_1
  Top 0.508: J1.6 105.38,93.88 107.06,92.2 U2.14
SOL4_1
  Top 0.508: J1.5 107.88,93.64 108.33,93.19 U2.13
SOL5_1
  Top 0.508: J1.4 110.38,93.8 109.65,93.07 109.65,87.62 U2.12
SOL6_1
  Top 0.508: J1.3 112.88,94.57 110.87,92.56 U2.11

### Text on the board
tPlace: S1 | S2 | S3 | S4 | S5 | S6 | 12V | PWM | PWM | PWM | 12V_GND | 12V_GND | 12V_GND | 12V | 12V | 12V | 12V_GND | PWMC0 | 12V | 12V_GND | PWMC1 | 12V
tNames: CS | MISO | MOSI | SCLK | GND | 5V | 12V_GND | 5V LED | 12V LED | X16 Backplane / Minh, Raghav, Daniel, Vijay / Dana Shi | 12V